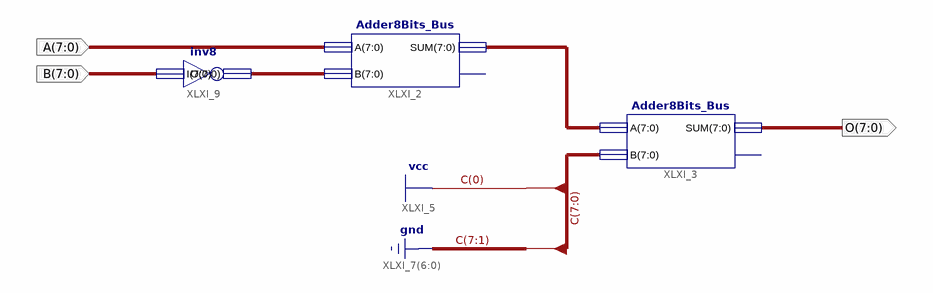
[diagram p0: schematic sheet 1]
// Xilinx ISE schematic Sub8Bits_Bus.sch (spartan6) as structural Verilog: 3 symbols, 3 ports
module Sub8Bits_Bus (
  input  [7:0] A,
  input  [7:0] B,
  output [7:0] O
);

  wire [7:0] XLXN_5, XLXN_9;

  Adder8Bits_Bus XLXI_3 (.A(XLXN_5), .B(8'b00000001), .SUM(O));  // open: C_OUT
  Adder8Bits_Bus XLXI_2 (.A(A), .B(XLXN_9), .SUM(XLXN_5));  // open: C_OUT
  inv8 XLXI_9 (.I(B), .O(XLXN_9));
endmodule
